# EAGLE design Watch1.1 (EAGLE 7.1.0)
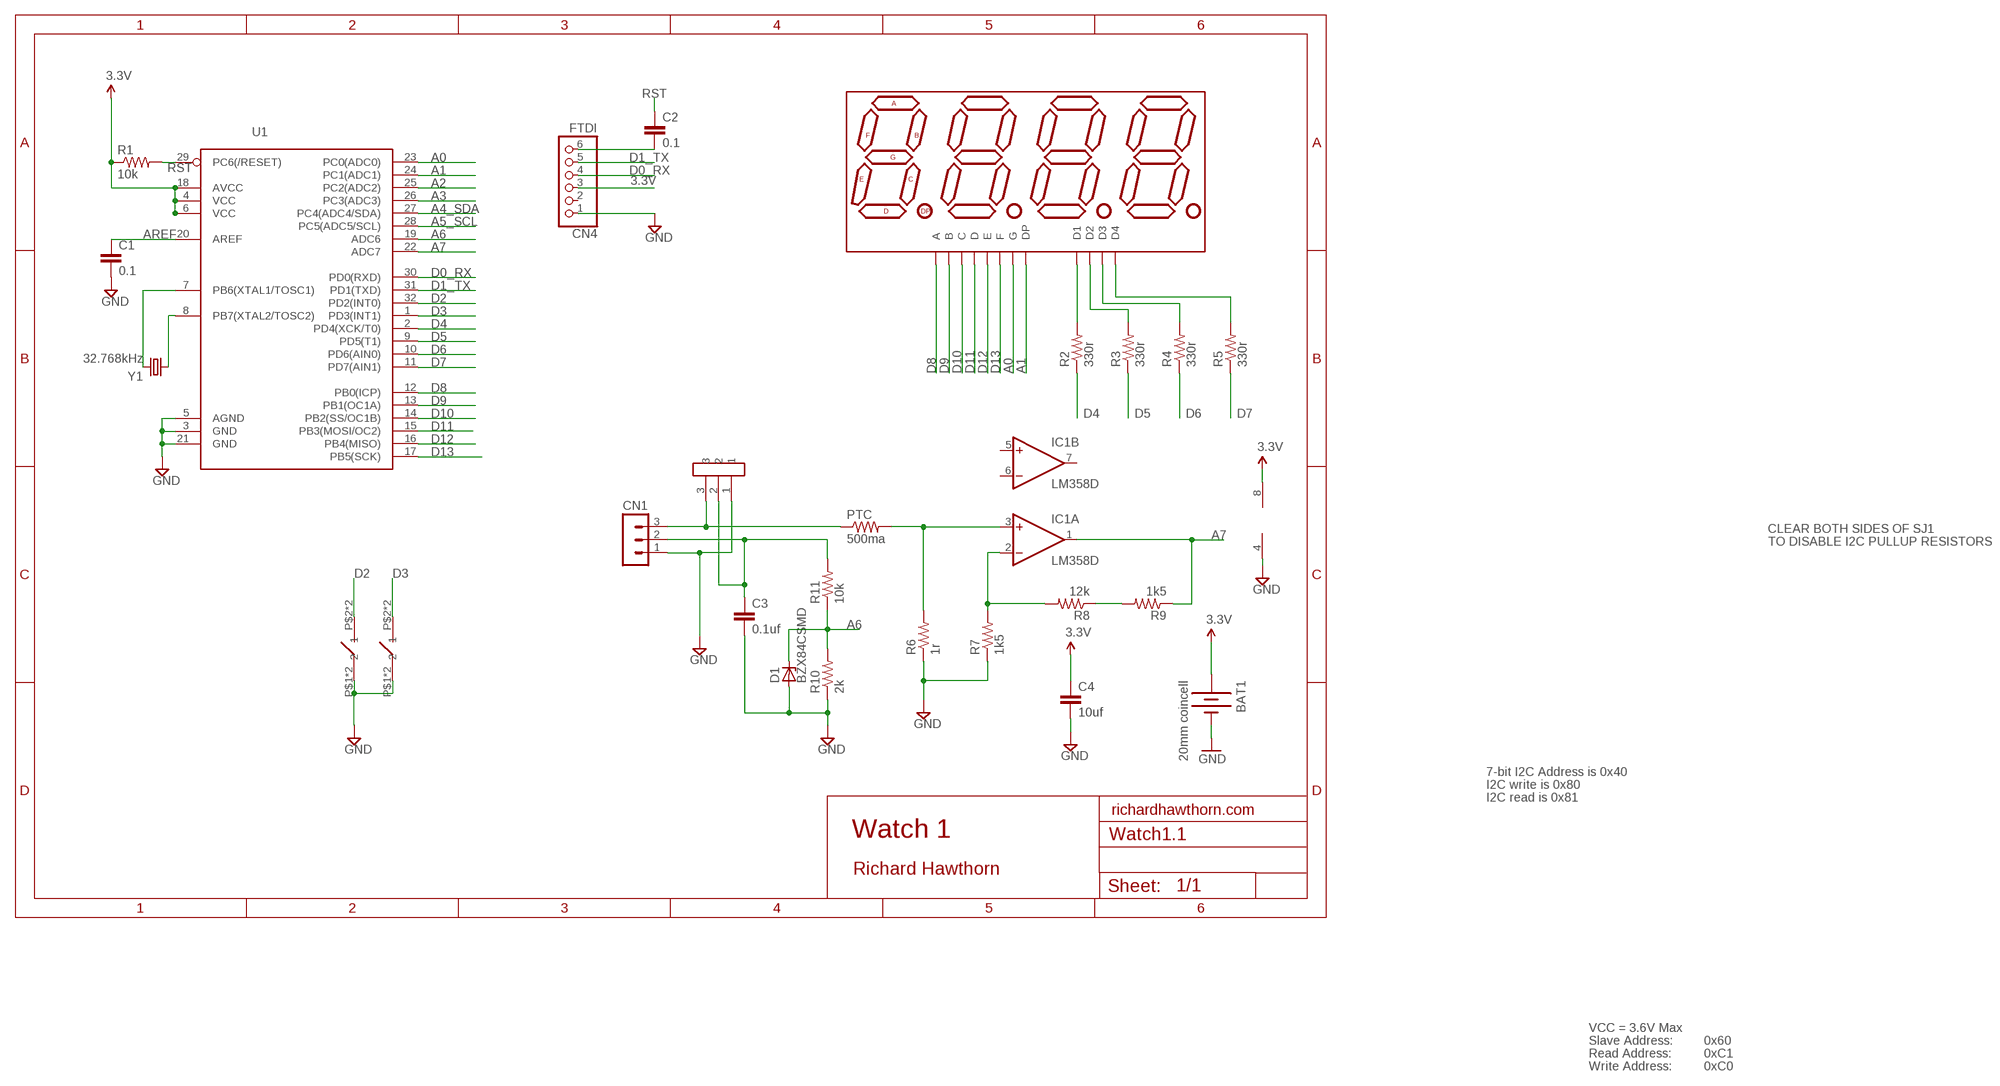
[diagram p0: schematic, sheet 1]

## Parts
BAT1  20mm coincell  BATTERY20MM_4LEGS_OVERPASTE  [BATTCON_20MM_4LEGS_OVERPASTE]
BTN1  TURTLE-3PIN  [TURTLE-3PIN]
BTN2  TURTLE-3PIN  [TURTLE-3PIN]
C1  0.1  CAP0603-CAP  [0603-CAP]
C2  0.1  CAP0603-CAP  [0603-CAP]
C3  0.1uf  CAP0603-CAP  [0603-CAP]
C4  10uf  CAP0603-CAP  [0603-CAP]
CN1  MA03-1  [MA03-1]
CN2  3PIN-HEADER-RA  [3PIN_HEAD_RA]
CN4  FTDI  PINHD-1X6  [1X06]
D1  BZX84CSMD  [TO236]
IC1  LM358D  [SO08]
LED1  HP_DISPLAY  [DIL12]
PTC  500ma  R-US_R1206  [R1206]
R1  10k  RESISTOR0603-RES  [0603-RES]
R2  330r  RESISTOR0805  [0805]
R3  330r  RESISTOR0805  [0805]
R4  330r  RESISTOR0805  [0805]
R5  330r  RESISTOR0805  [0805]
R6  1r  RESISTOR0805  [0805]
R7  1k5  RESISTOR0805  [0805]
R8  12k  RESISTOR0805  [0805]
R9  1k5  RESISTOR0805  [0805]
R10  2k  RESISTOR0805  [0805]
R11  10k  RESISTOR0805  [0805]
U1  ATMega-328  ATMEGA168/328TQFP32  [TQFP32-08]
Y1  32.768kHz  CRYSTALTC26H_EZ  [TC26HEZ]

## Nets
3.3V: BAT1.1(+) C4.1 CN4.3 IC1.8(P:V+) R1.1 U1.4(VCC) U1.6(VCC) U1.18(AVCC)
A0: LED1.7(G) U1.23(PC0(ADC0))
A1: LED1.5(DP) U1.24(PC1(ADC1))
A2: U1.25(PC2(ADC2))
A3: U1.26(PC3(ADC3))
A4_SDA: U1.27(PC4(ADC4/SDA))
A5_SCL: U1.28(PC5(ADC5/SCL))
A6: D1.C R10.2 R11.1 U1.19(ADC6)
A7: IC1.1(A:OUT) R9.1 U1.22(ADC7)
AREF: C1.1 U1.20(AREF)
D0_RX: CN4.4 U1.30(PD0(RXD))
D1_TX: CN4.5 U1.31(PD1(TXD))
D2: BTN1.P$2 BTN1.P$4 U1.32(PD2(INT0))
D3: BTN2.P$2 BTN2.P$4 U1.1(PD3(INT1))
D4: R2.1 U1.2(PD4(XCK/T0))
D5: R3.1 U1.9(PD5(T1))
D6: R4.1 U1.10(PD6(AIN0))
D7: R5.1 U1.11(PD7(AIN1))
D8: LED1.12(A) U1.12(PB0(ICP))
D9: LED1.11(B) U1.13(PB1(OC1A))
D10: LED1.3(C) U1.14(PB2(SS/OC1B))
D11: LED1.8(D) U1.15(PB3(MOSI/OC2))
D12: LED1.2(E) U1.16(PB4(MISO))
D13: LED1.9(F) U1.17(PB5(SCK))
GND [power]: BAT1.2(-) BTN1.P$1 BTN1.P$3 BTN2.P$1 BTN2.P$3 C1.2 C3.2 C4.2 CN1.1 CN2.1 CN4.1 D1.A IC1.4(P:V-) R6.1 R7.1 R10.1 U1.3(GND) U1.5(AGND) U1.21(GND)
N$1: U1.7(PB6(XTAL1/TOSC1)) Y1.2
N$3: LED1.1(D1) R2.2
N$4: LED1.10(D2) R3.2
N$5: LED1.4(D3) R4.2
N$6: LED1.6(D4) R5.2
N$7 [power]: CN1.3 CN2.3 PTC.1
N$8 [power]: IC1.3(A:+IN) PTC.2 R6.2
N$9: IC1.2(A:-IN) R7.2 R8.2
N$11: R8.1 R9.2
N$13: U1.8(PB7(XTAL2/TOSC2)) Y1.1
N$14: C3.1 CN1.2 CN2.2 R11.2
N$20: C2.2 CN4.6
RST: C2.1 R1.2 U1.29(PC6(/RESET))
Unconnected: CN4.2 IC1.5(B:+IN) IC1.6(B:-IN) IC1.7(B:OUT)

## Notes on the sheet
- CLEAR BOTH SIDES OF SJ1
- TO DISABLE I2C PULLUP RESISTORS
- 7-bit I2C Address is 0x40
- I2C write is 0x80
- I2C read is 0x81
- richardhawthorn.com
- Watch 1
- Richard Hawthorn
- VCC = 3.6V Max
- Slave Address: | 0x60
- Read Address: | 0xC1
- Write Address: | 0xC0

## Library data of the parts
BAT1 = SparkFun-Electromechanical:BATTERY: Battery Holders Various common sizes : AA, AAA, 20mm coin cell and 12mm coin cell. 20MM_4LEGS, BATT-10373
BTN1 BTN2 = Richards:TURTLE-3PIN
C1-C4 = LowPowerLab:CAP: Capacitor Standard 0603 ceramic capacitor, and 0.1" leaded capacitor.
CN1 = con-lstb:MA03-1: PIN HEADER; OC_FARNELL: unknown; OC_NEWARK: unknown
CN2 = Richard1:3PIN-HEADER-RA: 3 pin right angle header
CN4 = pinhead:PINHD-1X6: PIN HEADER
D1 = diode:BZX84CSMD: Z DIODE
IC1 = linear:LM358: OP AMP also LM158; LM258; LM2904 Source: http://cache.national.com/ds/LM/LM158.pdf
LED1 = playground:HP_DISPLAY
PTC = rcl:R-US_: RESISTOR, American symbol
R1-R11 = LowPowerLab:RESISTOR: Resistor Basic schematic elements and footprints for 0603, 1206, and PTH resistors.
U1 = LowPowerLab:ATMEGA168/328: Atmel 32-pin 8-bit micro, 16k flash.
Y1 = SparkFun-FreqCtrl:CRYSTAL: Various standard crystals. Proven footprints. Spark Fun Electronics SKU : COM-00534

## Net classes
1 power: width 0.508 mm, clearance 0.254 mm

## Board
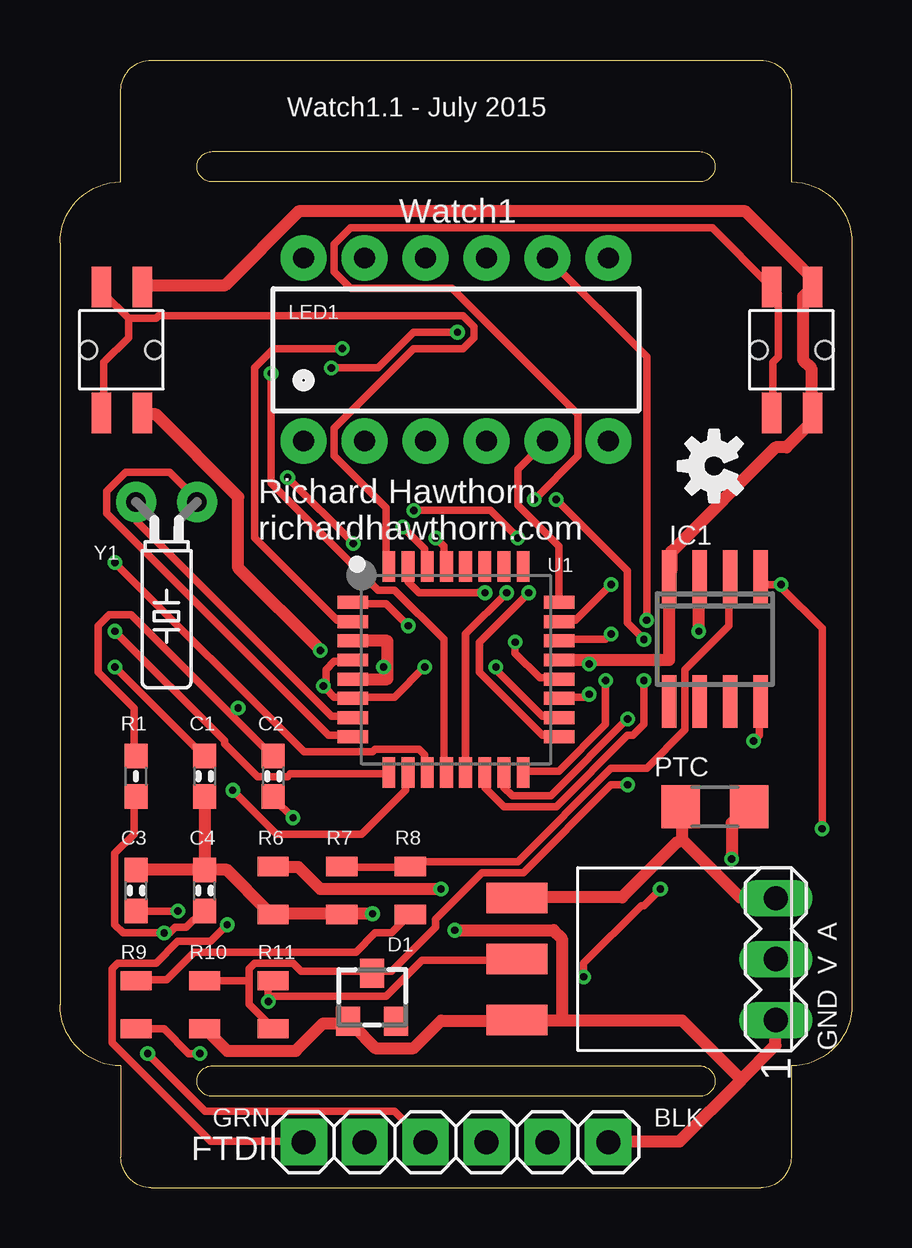
[diagram p1: board, top side]
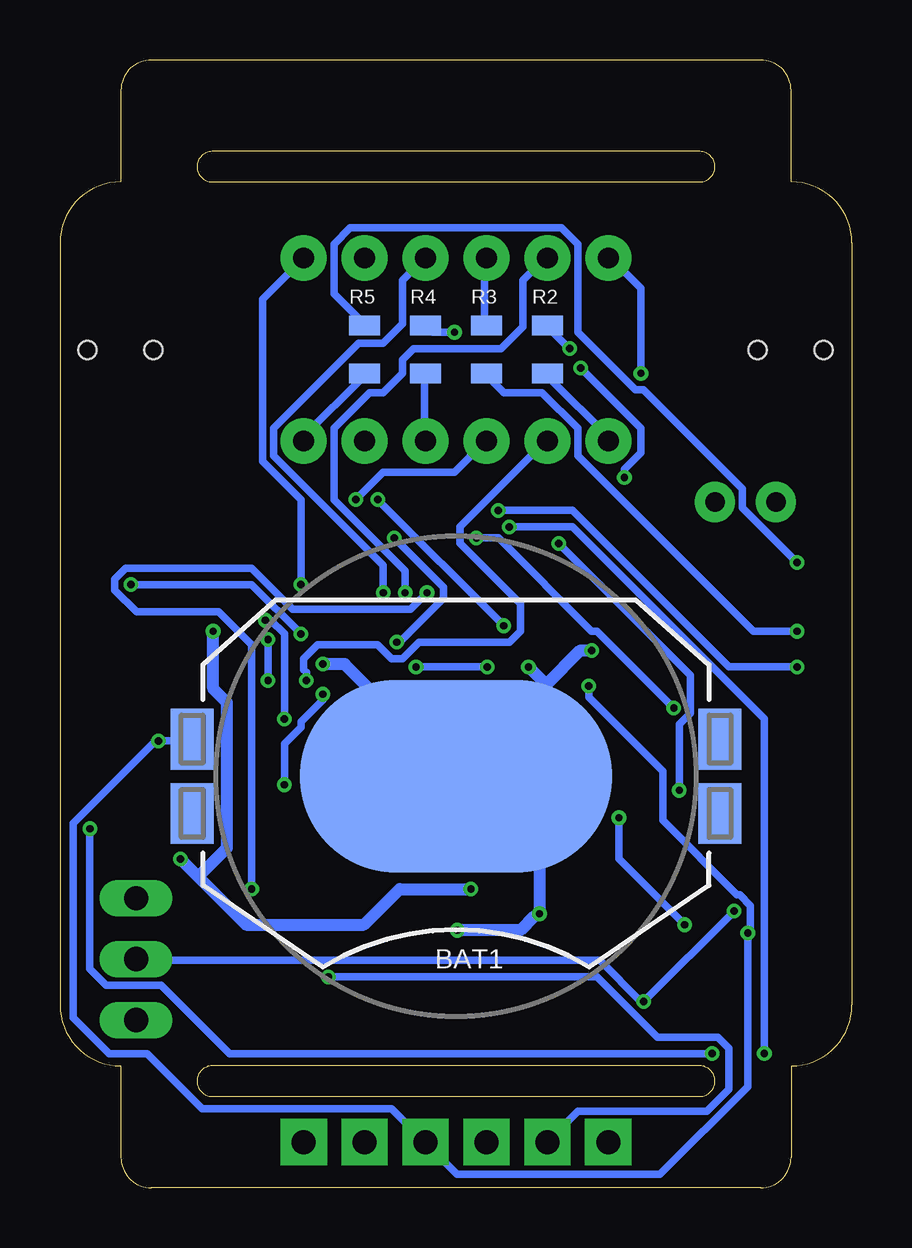
[diagram p2: board, bottom side, seen from below]

Size 33.02 x 46.99 mm. Coordinates in mm from the lower left corner, seen from the top.
Outline: 6.35,43.18 26.67,43.18 arc-180 26.67,41.91 6.35,41.91 arc-180 6.35,43.18
Outline: 2.54,41.91 2.54,45.72 arc-90 3.81,46.99 29.21,46.99 arc-90 30.48,45.72 30.48,41.91 arc-90 33.02,39.37 33.02,7.62 arc-90 30.48,5.08 30.48,1.27 arc-90 29.21,0 3.81,0 arc-90 2.54,1.27 2.54,5.08 arc-90 0,7.62 0,39.37 arc-90 2.54,41.91
Outline: 6.35,5.08 26.67,5.08 arc-180 26.67,3.81 6.35,3.81 arc-180 6.35,5.08
Copper layers (1*16): Top 0.035mm / dielectric 1.5mm / Bottom 0.035mm
Design rules "ITEADstudio_DRC *": minimum track width 12mil, minimum drill 12mil, track to track 6mil, track to pad 6mil, pad to pad 6mil, via to via 6mil, smd to smd 0mil, copper to edge 10mil, drill to drill 10mil, minimum pad ring 10mil, minimum via ring 6mil, stop-mask expansion 2mil, vias tented up to drill 100mil, thermal gap 15mil
tRestrict: area 24.3,7.6 to 29.1,11.6; area 5.8,15.6 to 6.9,17.3; area 5.2,8.4 to 6.7,9.1
bRestrict: area 27.4,16.4 to 29.2,17.4; area 21.1,12.6 to 22.9,13.6; area 21.6,11.3 to 22.1,11.9; area 20.7,11.3 to 21.2,11.9; area 20.2,11.6 to 20.7,12.2; area 20.1,12.1 to 20.6,12.8; area 26.5,17.6 to 27.1,18.2; area 26.5,16.6 to 27.1,17.2; area 27.5,17.9 to 28,18.5; area 27.9,17.6 to 29.1,18.3

### Footprints (pad centres in the part's own frame; a part is rotated, then mirrored left to right if it is on the bottom)
BATTCON_20MM_4LEGS_OVERPASTE = smd 1.778 x 2.54: 1 -11,1.55; 3 11,1.55; P$1 -11,-1.55; P$2 11,-1.55 | smd 13 x 8: 2 0,0
TURTLE-3PIN = smd 1.676 x 0.813: P$1 -2.64,-0.889; P$2 -2.64,0.811; P$3 2.61,-0.889; P$4 2.61,0.811 | hole 0.75: -0.015,-1.389; -0.015,1.361
0603-CAP = smd 1.016 x 0.965: 1 -0.85,0; 2 0.85,0
MA03-1 = drill 1.016 long: 1 -2.54,0; 2 0,0; 3 2.54,0
3PIN_HEAD_RA = smd 2.54 x 1.27: 1 1.27,1.27; 2 1.27,3.81; 3 1.27,6.35
1X06 = drill 1 pad 1.93 square: 1 -6.35,0; 2 -3.81,0; 3 -1.27,0; 4 1.27,0; 5 3.81,0; 6 6.35,0
TO236 = smd 1 x 1.2: A -1,-1; C 0,1; NC 1,-1
SO08 = smd 0.6 x 2.2: 1 -1.905,-2.6; 2 -0.635,-2.6; 3 0.635,-2.6; 4 1.905,-2.6; 5 1.905,2.6; 6 0.635,2.6; 7 -0.635,2.6; 8 -1.905,2.6
DIL12 = drill 0.864 pad 1.905: 1 -6.35,-3.81; 2 -3.81,-3.81; 3 -1.27,-3.81; 4 1.27,-3.81; 5 3.81,-3.81; 6 6.35,-3.81; 7 6.35,3.81; 8 3.81,3.81; 9 1.27,3.81; 10 -1.27,3.81; 11 -3.81,3.81; 12 -6.35,3.81
R1206 = smd 1.6 x 1.803: 1 -1.422,0; 2 1.422,0
0603-RES = smd 1.016 x 0.965: 1 -0.85,0; 2 0.85,0
0805 = smd 0.8 x 1.3: 1 -1,0; 2 1,0
TQFP32-08 = smd 1.27 x 0.533: 1 -4.293,2.8; 2 -4.293,2; 3 -4.293,1.2; 4 -4.293,0.4; 5 -4.293,-0.4; 6 -4.293,-1.2; 7 -4.293,-2; 8 -4.293,-2.8; 17 4.293,-2.8; 18 4.293,-2; 19 4.293,-1.2; 20 4.293,-0.4; 21 4.293,0.4; 22 4.293,1.2; 23 4.293,2; 24 4.293,2.8 | smd 0.533 x 1.27: 9 -2.8,-4.293; 10 -2,-4.293; 11 -1.2,-4.293; 12 -0.4,-4.293; 13 0.4,-4.293; 14 1.2,-4.293; 15 2,-4.293; 16 2.8,-4.293; 25 2.8,4.293; 26 2,4.293; 27 1.2,4.293; 28 0.4,4.293; 29 -0.4,4.293; 30 -1.2,4.293; 31 -2,4.293; 32 -2.8,4.293
TC26HEZ = drill 0.813 pad 1.676: 1 -1.27,0; 2 1.27,0

### Placement (x,y rotation side)
BAT1  16.51,17.14 0 bottom
BTN1  2.54,34.92 90 top
BTN2  30.48,34.92 90 top
C1  6.03,17.14 270 top
C2  8.89,17.14 270 top
C3  3.17,12.38 90 top
C4  6.03,12.38 90 top
CN1  29.84,9.53 90 top
CN2  17.78,5.71 0 top
CN4  16.51,1.9 180 top
D1  13.02,7.94 0 top
IC1  27.3,22.86 180 top
LED1  16.51,34.92 0 top
PTC  27.3,15.88 0 top
R1  3.17,17.14 90 top
R2  12.7,34.92 270 bottom
R3  15.24,34.92 90 bottom
R4  17.78,34.92 270 bottom
R5  20.32,34.92 270 bottom
R6  8.89,12.38 90 top
R7  11.75,12.38 90 top
R8  14.61,12.38 90 top
R9  3.17,7.62 90 top
R10  6.03,7.62 90 top
R11  8.89,7.62 90 top
U1  16.51,21.59 0 top
U$3  [OSHW-LOGO-S]  27.27,30.07 90 top
Y1  4.45,28.57 180 top

### Tracks (layer width: path | path; a pad name or v marks a point on that pad's centre or on a via)
3.3V  (via drill 0.3)
  Top 0.305: 11.09,20.9 11.09,21.59 11.43,21.93 12.12,21.93 U1.4 | 11.09,20.9 11.09,20.79 11.43,20.45 12.12,20.45 U1.6 12.34,20.45 13.95,20.45 v15.2,21.7 | v18.17,21.7 18.17,21.59 20.12,19.65 20.8,19.65 U1.18 | R1.1 3.09,16.22 3.09,14.73 2.29,13.93 2.29,10.96 2.63,10.62 v4.34,10.62 4.57,10.62 4.8,10.85 5.26,10.85 5.94,11.53 C4.1 | v28.92,18.62 29.15,18.85 29.15,20.22 IC1.8 | v10.97,20.9 11.09,20.9
  Bottom 0.305: v15.2,21.7 v18.17,21.7 | BAT1.1 27.55,18.73 28.12,18.73 28.23,18.62 v28.92,18.62 29.03,18.62 32.46,15.19 32.46,7.07 30.98,5.59 29.38,5.59 27.09,3.3 19.2,3.3 17.83,1.93 CN4.3 17.72,1.82 16.46,0.56 8,0.56 4.34,4.22 v4.34,10.62 4.23,10.62 4.23,11.76 4.69,12.22 4.8,12.22 7.89,15.3 7.89,17.36 10.97,20.45 v10.97,20.9
A0  (via drill 0.3)
  Top 0.305: v22.97,25.13 21.49,23.65 20.8,23.65 U1.23
  Bottom 0.305: v22.97,25.13 22.97,28.68 24.57,30.28 24.57,37.02 LED1.7
A1
  Top 0.305: U1.24 20.8,26.73 19.09,28.45 19.09,29.93 20.23,31.08 LED1.5
A6  (via drill 0.3)
  Top 0.305: 7.89,8.62 7.89,9.13 8.12,9.36 9.72,9.36 10.06,9.02 12.92,9.02 D1.C 13.14,9.02 13.83,9.02 15.66,10.85 15.66,11.19 17.6,13.13 19.32,13.13 22.97,16.79 v23.66,16.79 | R11.1 8.8,6.73 7.89,7.64 7.89,8.57 7.89,8.62 | v22.06,20.56 21.95,20.45 20.8,20.45 U1.19 | R10.2 7.89,8.62
  Bottom 0.305: v22.06,20.56 22.06,20.33 22.97,19.42 22.97,19.19 23.66,18.5 v23.66,16.79
A7  (via drill 0.3)
  Top 0.305: v22.97,23.08 22.75,22.85 20.8,22.85 U1.22 | IC1.1 29.26,25.36 29.49,25.13 v30.06,25.13 30.06,25.02 31.77,23.3 v31.77,14.96 | v5.83,5.59 5.37,5.59 4.34,6.62 3.2,6.62 R9.1
  Bottom 0.305: v22.97,23.08 25.03,25.13 v30.06,25.13 | v5.83,5.59 25.95,5.59 28.8,8.45 31.09,8.45 31.77,9.13 v31.77,14.96
AREF  (via drill 0.3)
  Top 0.305: v2.29,21.7 5.94,18.05 C1.1 | v14.74,28.22 17.95,28.22 v19.09,27.08 | v18.97,22.73 18.97,22.28 20,21.25 20.8,21.25 U1.20
  Bottom 0.305: v2.29,21.7 5.14,21.7 11.66,28.22 v14.74,28.22 | v19.09,27.08 17.03,25.02 17.03,24.56 18.86,22.73 v18.97,22.73
D0_RX  (via drill 0.3)
  Top 0.305: v14.29,27.53 15.2,26.62 15.2,25.93 U1.30 | v3.66,5.59 6.06,3.19 13.95,3.19 15.2,1.93 CN4.4
  Bottom 0.305: v14.29,27.53 11.66,27.53 3.66,19.53 v3.66,5.59
D1_TX  (via drill 0.3)
  Top 0.305: v17.72,24.79 14.97,24.79 14.52,25.25 14.52,25.82 U1.31 | v25.03,12.45 24.35,11.76 24.23,11.76 21.83,9.36 v21.83,8.79
  Bottom 0.305: v17.72,24.79 18.4,24.11 23.32,24.11 25.03,25.82 30.29,25.82 30.75,25.36 30.75,24.91 29.83,23.99 26.4,23.99 25.03,22.62 v25.03,12.45 | v21.83,8.79 10.63,8.79 8.12,6.27 5.6,6.27 5.14,5.82 5.14,4.1 6.06,3.19 11.43,3.19 12.69,1.93 CN4.5
D2
  Top 0.305: 2.86,36.22 4,36.22 4.12,36.33 16.8,36.33 17.26,35.88 17.26,35.42 16.8,34.96 14.74,34.96 11.43,31.65 11.43,30.5 13.6,28.33 13.6,25.93 U1.32 | 2.86,36.22 1.83,37.25 1.83,37.48 BTN1.P$4 | 2.86,36.22 2.86,35.42 1.83,34.39 1.83,32.33 BTN1.P$2
D3  (via drill 0.3)
  Top 0.305: v14.52,23.42 13.6,24.33 12.23,24.33 U1.1 | v19.77,28.68 21.6,30.5 21.6,32.22 16.34,37.48 12.12,37.48 11.43,38.16 11.43,39.31 12.12,39.99 27.2,39.99 29.6,37.59 BTN2.P$4 29.72,37.48 29.95,37.25 29.95,34.62 29.72,34.39 29.72,32.33 BTN2.P$2
  Bottom 0.305: v19.77,28.68 v14.52,23.42
D4  (via drill 0.3)
  Top 0.305: v11.77,34.96 8.91,34.96 8.12,34.16 8.12,27.08 11.54,23.65 12.12,23.65 U1.2
  Bottom 0.305: v11.77,34.96 12.69,35.88 R2.1
D5  (via drill 0.3)
  Top 0.305: v2.29,23.19 6.86,18.62 6.86,18.5 8.23,17.13 9.49,17.13 9.6,17.25 13.6,17.25 U1.9
  Bottom 0.305: v2.29,23.19 4.12,23.19 11.43,30.5 11.43,31.65 12.92,33.13 14.52,33.13 15.2,33.82 R3.1
D6  (via drill 0.3)
  Top 0.305: v7.2,16.56 9.03,14.73 12.57,14.73 14.4,16.56 14.4,17.25 U1.10 | v9.49,29.59 v12.23,26.85 | v11.32,34.16 13.26,34.16 14.74,35.65 v16.57,35.65
  Bottom 0.305: v7.2,16.56 7.2,19.3 6.74,19.76 6.74,21.36 v12.23,26.85 | v9.49,29.59 9.49,29.93 8.8,30.62 8.8,31.65 v11.32,34.16 | v16.57,35.65 17.49,35.65 17.72,35.88 R4.1
D7  (via drill 0.3)
  Top 0.305: v2.29,26.05 10.17,18.16 13.03,18.16 13.14,18.28 14.97,18.28 15.2,18.05 15.2,17.36 U1.11
  Bottom 0.305: v2.29,26.05 4.57,28.33 4.57,29.13 8.69,33.25 9.03,33.25 11.43,35.65 11.43,39.31 12.12,39.99 20.92,39.99 21.6,39.31 21.6,37.25 20.34,35.99 R5.1
D8  (via drill 0.3)
  Top 0.305: v8.8,33.93 8.8,29.36 13.26,24.91 13.95,24.91 16,22.85 16,17.36 U1.12
  Bottom 0.305: v8.8,33.93 8.8,37.48 10.06,38.73 LED1.12
D9  (via drill 0.3)
  Top 0.305: v18.63,24.79 16.92,23.08 16.92,17.36 U1.13
  Bottom 0.305: v18.63,24.79 18.63,25.71 21.6,28.68 21.6,31.65 20.12,33.13 19.55,33.13 18.75,33.93 18.75,34.51 18.29,34.96 14.63,34.96 13.72,35.88 13.72,37.82 12.8,38.73 LED1.11
D10  (via drill 0.3)
  Top 0.305: v24.35,21.13 24.35,19.3 23.89,18.85 23.66,18.85 20.69,15.88 18.52,15.88 17.72,16.68 17.72,17.25 U1.14 | v24.35,22.85 23.66,23.53 23.66,25.71 v20.69,28.68
  Bottom 0.305: v24.35,22.85 v24.35,21.13 | v20.69,28.68 19.55,29.82 16.57,29.82 15.32,31.08 LED1.3
D11  (via drill 0.3)
  Top 0.305: v23.66,19.53 20.46,16.33 18.86,16.33 18.52,16.68 18.52,17.25 U1.15 | v24.46,23.65 24.46,34.62 20.34,38.73 LED1.8
  Bottom 0.305: v23.66,19.53 23.66,23.08 24.23,23.65 v24.46,23.65
D12  (via drill 0.3)
  Top 0.305: v22.75,21.13 22.75,19.3 20.8,17.36 19.32,17.36 U1.16
  Bottom 0.305: v22.75,21.13 22.75,21.48 22.86,21.59 22.86,22.05 22.29,22.62 19.77,22.62 19.2,22.05 18.75,22.05 18.06,22.73 14.29,22.73 13.83,23.19 13.83,24.33 16.34,26.85 16.34,27.53 12.8,31.08 LED1.2
D13  (via drill 0.3)
  Top 0.305: v19.55,24.79 17.49,22.73 17.49,21.48 20.12,18.85 20.8,18.85 U1.17
  Bottom 0.305: v19.55,24.79 19.55,25.93 24.12,30.5 24.12,31.65 20.57,35.19 19.55,35.19 18.75,35.99 18.75,37.82 17.83,38.73 LED1.9
GND  (via drill 0.3)
  Top 0.508: C1.2 C4.2 | U1.21 22.06,21.99 | 22.06,21.99 25.4,21.99 IC1.4 25.49,25.71 25.49,26.5 29.83,30.85 30.29,30.85 31.2,31.76 31.2,32.11 BTN2.P$1 31.32,32.33 31.32,34.16 30.98,34.51 30.98,37.13 31.2,37.36 BTN2.P$3 31.32,37.59 31.32,37.93 28.57,40.68 9.94,40.68 6.86,37.59 3.43,37.59 BTN1.P$3 | U1.5 13.65,21.19 13.65,21.7 | 13.65,21.7 13.65,22.78 U1.3 | R10.1 6.06,6.62 6.97,5.7 9.83,5.7 10.97,6.85 12,6.85 D1.A 12.23,6.73 13.14,5.82 14.74,5.82 15.89,6.96 18.97,6.96 CN2.1 19.32,6.96 20.92,6.96 | 28.4,4.5 25.83,1.93 22.86,1.93 CN4.1 | 28.4,4.5 29.83,5.93 29.83,6.96 CN1.1 | 20.92,6.96 25.95,6.96 28.4,4.5 | C3.2 3.2,13.25 5.83,13.25 C4.2 | C4.2 6.29,13.25 6.97,13.25 8.69,11.53 R6.1 8.91,11.42 11.66,11.42 R7.1 12,11.42 v13.03,11.42 | v10.86,22.39 7.43,25.82 7.43,28.79 4,32.22 3.43,32.22 BTN1.P$1 | v13.49,21.7 13.65,21.7 | 20.92,6.96 20.92,10.39 20.57,10.73 v16.46,10.73 | v22.06,21.82 22.06,21.99
  Bottom 0.508: v10.86,22.39 11.32,22.39 12.74,20.96 | 12.74,20.96 16.46,17.25 BAT1.2 | 12.74,20.96 v13.49,21.7 | BAT1.2 16.46,16.9 13.03,13.47 v13.03,11.42 13.26,11.3 13.83,10.73 v16.46,10.73 | v22.06,21.82 21.14,21.82 16.69,17.36 BAT1.2
N$1
  Top 0.305: U1.7 12.12,19.65 11.32,19.65 3.2,27.76 3.2,28.56 Y1.2
N$3
  Bottom 0.305: R2.2 12.69,33.82 10.06,31.19 LED1.1
N$4
  Bottom 0.305: R3.2 15.32,35.99 15.32,38.73 LED1.10
N$5
  Bottom 0.305: R4.2 17.83,33.82 17.83,31.19 LED1.4
N$6
  Bottom 0.305: LED1.6 22.86,31.31 20.34,33.82 R5.2
N$7
  Top 0.508: 25.95,14.5 25.95,15.88 PTC.1 | 25.95,14.5 28.35,12.1 29.83,12.1 CN1.3 | CN2.3 19.09,12.1 23.43,12.1 25.72,14.39 25.95,14.5
N$8  (via drill 0.3)
  Top 0.508: v15.89,12.45 10.86,12.45 9.94,13.36 8.91,13.36 R6.2 | v28,13.7 28,15.19 28.69,15.88 PTC.2 | v26.63,23.19 26.63,25.36 IC1.3
  Bottom 0.508: v15.89,12.45 18.86,12.45 20.34,10.96 25.26,10.96 27.26,12.96 | v28,13.7 27.26,12.96 | v26.63,23.19 26.63,20.79 26.06,20.22 26.06,14.16 27.26,12.96
N$9
  Top 0.305: R7.2 11.77,13.36 14.52,13.36 R8.2 14.74,13.36 14.97,13.59 19.09,13.59 22.97,17.48 24.46,17.48 26.06,19.07 26.06,21.59 27.89,23.42 27.89,25.36 IC1.2
N$11
  Top 0.305: R9.2 3.2,8.67 4.46,8.67 5.6,9.82 12.34,9.82 13.14,10.62 13.83,10.62 14.52,11.3 R8.1
N$13
  Top 0.305: U1.8 12.12,18.85 11.2,18.85 1.94,28.11 1.94,29.02 2.74,29.82 4.57,29.82 5.71,28.68 Y1.1
N$14  (via drill 0.3)
  Top 0.305: v4.92,11.53 3.2,11.53 C3.1 | R11.2 8.8,8.56 8.69,8.45 v8.69,7.76 8.8,7.99 13.6,7.99 15.09,9.47 18.97,9.47 CN2.2
  Bottom 0.305: v4.92,11.53 v8.69,7.76 8.8,7.76 10.52,9.47 29.83,9.47 CN1.2
N$20  (via drill 0.3)
  Top 0.305: v9.72,15.42 8.91,16.22 C2.2 | v6.97,10.96 6.29,10.27 4.92,10.27 4,9.36 2.4,9.36 2.17,9.13 2.17,6.04 6.29,1.93 10.06,1.93 CN4.6
  Bottom 0.305: v9.72,15.42 9.72,13.7 v6.97,10.96
RST  (via drill 0.3)
  Top 0.305: 7.14,19.7 8.8,18.05 C2.1 | 7.14,19.7 2.97,23.88 2.06,23.88 1.6,23.42 1.6,21.48 3.09,19.99 3.09,18.05 R1.2 | v15.66,27.08 16,26.73 16,25.93 U1.29 | 7.14,19.7 v7.43,19.99
  Bottom 0.305: v15.66,27.08 14.74,27.08 10.86,23.19 10.63,23.19 v7.43,19.99

### Text on the board
tNames: Watch1.1 - July 2015 | Watch1 | Richard Hawthorn / richardhawthorn.com | GND V A | GRN | BLK | FTDI
tDocu: REG